# EAGLE design ziffy_board_v4 (EAGLE 6.5.0)
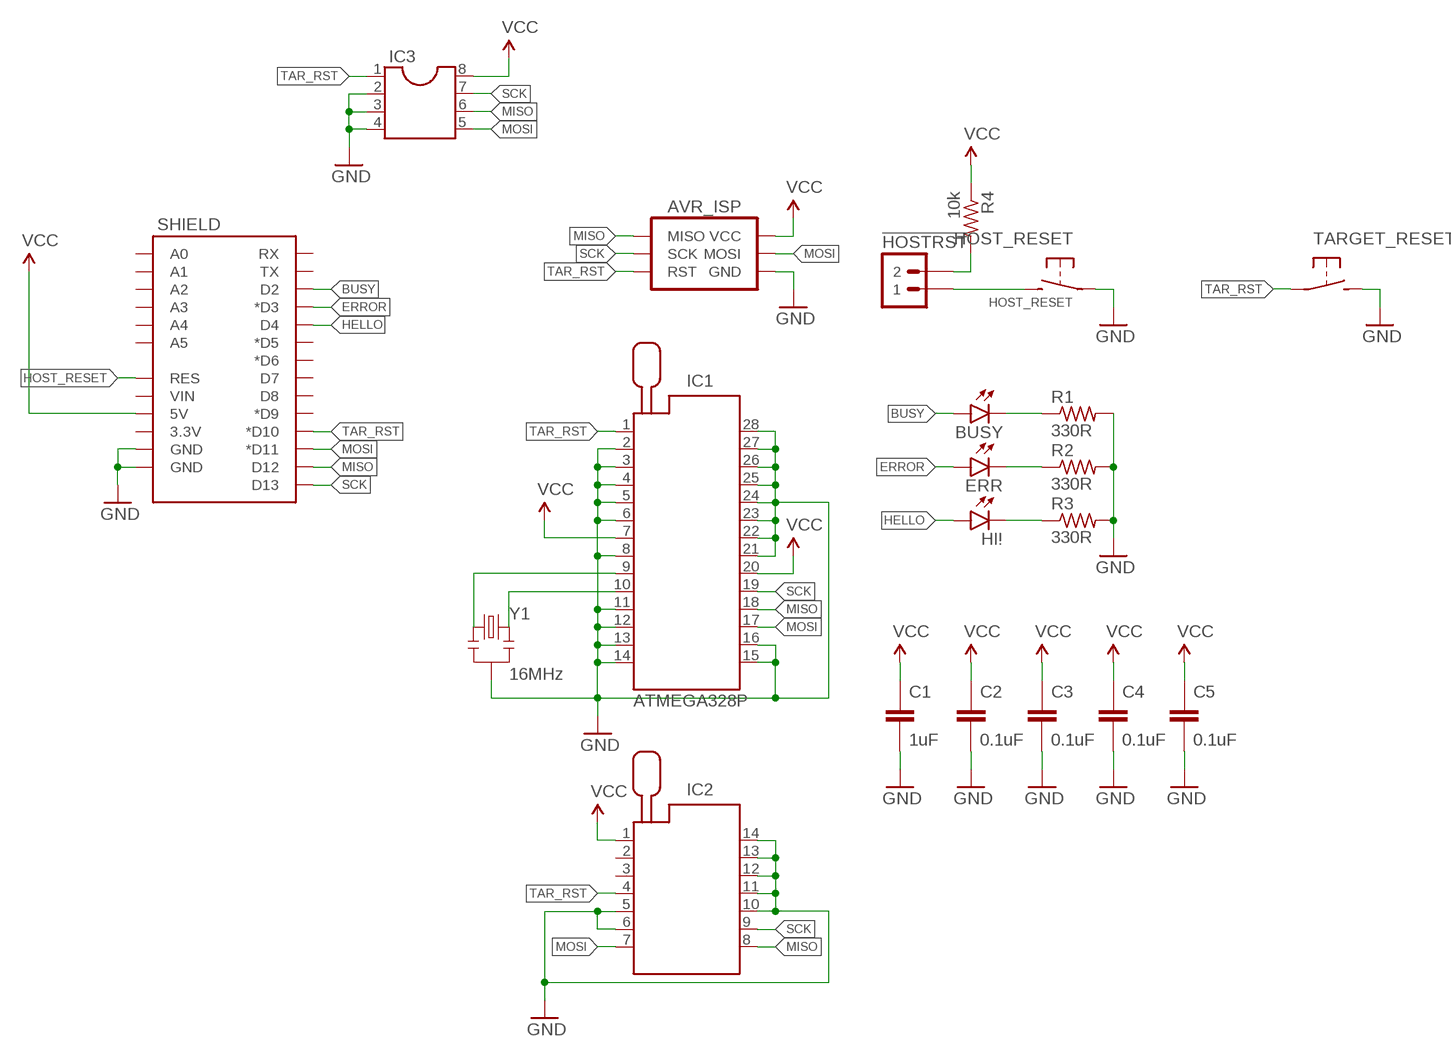
[diagram p0: schematic, sheet 1]

## Parts
!HOSTRST  M02PTH  [1X02]
AVR_ISP  AVR_SPI_PRG_6PTH-SHROUD  [2X3-SHROUDED]
BUSY  YELLOW  LED3MM  [LED3MM]
C1  1uF  CAPACITOR-CERAMIC025-024X044  [C025-024X044]
C2  0.1uF  CAPACITOR-CERAMIC025-024X044  [C025-024X044]
C3  0.1uF  CAPACITOR-CERAMIC025-024X044  [C025-024X044]
C4  0.1uF  CAPACITOR-CERAMIC025-024X044  [C025-024X044]
C5  0.1uF  CAPACITOR-CERAMIC025-024X044  [C025-024X044]
ERR  RED  LED3MM  [LED3MM]
HI!  GREEN  LED3MM  [LED3MM]
HOST_RESET  SPST-NO-TACT3MM-PTH-SMALL-PADS  [DTS-3-SMALL-PADS]
IC1  ATMEGA328P  ZIF28  [ZIF28]
IC2  ATTINY84  ZIF14  [ZIF14]
IC3  DIL8  [DIL08]
R1  330R  RESISTORPTH-AXIAL-6.35MM  [RESISTOR-AXIAL-PTH-6.35MM]
R2  330R  RESISTORPTH-AXIAL-6.35MM  [RESISTOR-AXIAL-PTH-6.35MM]
R3  330R  RESISTORPTH-AXIAL-6.35MM  [RESISTOR-AXIAL-PTH-6.35MM]
R4  10k  RESISTORPTH-AXIAL-5.08MM  [RESISTOR-AXIAL-PTH-5.08MM]
SHIELD  ARDUINO_SHIELD_SMALLER  [ARDUINO_SHIELD_NOOUTLINE_INSIDE_SMALLER]
TARGET_RESET  SPST-NO-TACT3MM-PTH-SMALL-PADS  [DTS-3-SMALL-PADS]
Y1  16MHz  RESONATORPTH  [RESONATOR-PTH]

## Nets
BUSY: BUSY.A SHIELD.D2
ERROR: ERR.A SHIELD.D3(*D3)
GND: AVR_ISP.6(GND) C1.2 C2.2 C3.2 C4.2 C5.2 HOST_RESET.1 IC1.2 IC1.3 IC1.4 IC1.5 IC1.6 IC1.8 IC1.11 IC1.12 IC1.13 IC1.14 IC1.15 IC1.16 IC1.21 IC1.22 IC1.23 IC1.24 IC1.25 IC1.26 IC1.27 IC1.28 IC2.5 IC2.6 IC2.10 IC2.11 IC2.12 IC2.13 IC2.14 IC3.2 IC3.3 IC3.4 R1.P$2 R2.P$2 R3.P$2 SHIELD.GND@0(GND) SHIELD.GND@1(GND) TARGET_RESET.2 Y1.2
HELLO: HI!.A SHIELD.D4
HOST_RESET: !HOSTRST.1 HOST_RESET.2 SHIELD.RES
MISO: AVR_ISP.1(MISO) IC1.18 IC2.8 IC3.6 SHIELD.D12
MOSI: AVR_ISP.4(MOSI) IC1.17 IC2.7 IC3.5 SHIELD.D11(*D11)
N$1: BUSY.K(C) R1.P$1
N$2: ERR.K(C) R2.P$1
N$3: HI!.K(C) R3.P$1
N$4: !HOSTRST.2 R4.P$2
N$29: IC1.9 Y1.1
N$33: IC1.10 Y1.3
SCK: AVR_ISP.3(SCK) IC1.19 IC2.9 IC3.7 SHIELD.D13
TAR_RST: AVR_ISP.5(RST) IC1.1 IC2.4 IC3.1 SHIELD.D10(*D10) TARGET_RESET.1
VCC: AVR_ISP.2(VCC) C1.1 C2.1 C3.1 C4.1 C5.1 IC1.7 IC1.20 IC2.1 IC3.8 R4.P$1 SHIELD.5V
Unconnected: IC2.2 IC2.3 SHIELD.3.3V SHIELD.A0 SHIELD.A1 SHIELD.A2 SHIELD.A3 SHIELD.A4 SHIELD.A5 SHIELD.D5(*D5) SHIELD.D6(*D6) SHIELD.D7 SHIELD.D8 SHIELD.D9(*D9) SHIELD.RX SHIELD.TX SHIELD.VIN

## Library data of the parts
!HOSTRST = A_butts:M02: Standard 2-pin 0.1" header. Use with - straight break away headers ( PRT-00116) - right angle break away headers (PRT-00553) - swiss pins (PRT-00743) - machine pins (PRT-00117) - female headers (PRT-00115) Molex polarized connector foot print use with: PRT-08233 with associated crimp pins and housings. 2.54_SCREWTERM for use with PRT-10571. 3.5mm Screw Terminal footprints for PRT-08084 5mm Screw Terminal footprints for use with PRT-08433
AVR_ISP = A_butts:AVR_SPI_PRG_6: AVR ISP 6 Pin This is the reduced ISP connector for AVR programming. Common on Arduino. This footprint will take up less PCB space and can be used with a 10-pin to 6-pin adapter such as SKU: BOB-08508 **Special note about "TEST_POINT" package. The stop mask is on the top side, so if you want your programming test points to be on the bottom of your board, make sure to place this package on the bottom side of the board. This also ensure that the orientation to program from the bottom side will be correct.
BUSY ERR HI! = A_butts:LED: LEDs Standard schematic elements and footprints for 5mm, 3mm, 1206, and 0603 sized LEDs. 5mm - Spark Fun Electronics SKU : COM-00529 (and others)
C1-C5 = A_butts:CAPACITOR-CERAMIC: CAPACITOR, European symbol
HOST_RESET TARGET_RESET = A_butts:SPST-NO-TACT
IC1 = A_butts:ZIF28: Zero Insertion Force Socked Source: http://www.3M.com/ehpd
IC2 = A_butts:ZIF14: Zero Insertion Force Socked Source: http://www.3M.com/ehpd; MF: 3M; MPN: 214-3339-00-0602J; OC_FARNELL: 1247151; OC_NEWARK: 85K7793
IC3 = A_butts:DIL8: Dual In Line / Socket
R1-R4 = A_butts:RESISTOR: RESISTOR, American symbol
SHIELD = A_butts:ARDUINO_SHIELD_SMALLER
Y1 = A_butts:RESONATOR: Resonator Small SMD resonator. Used, eg, on the Arduino Pro/ Pro Mini boards. 8MHz- XTAL-08895 16MHz- XTAL-08900

## Board
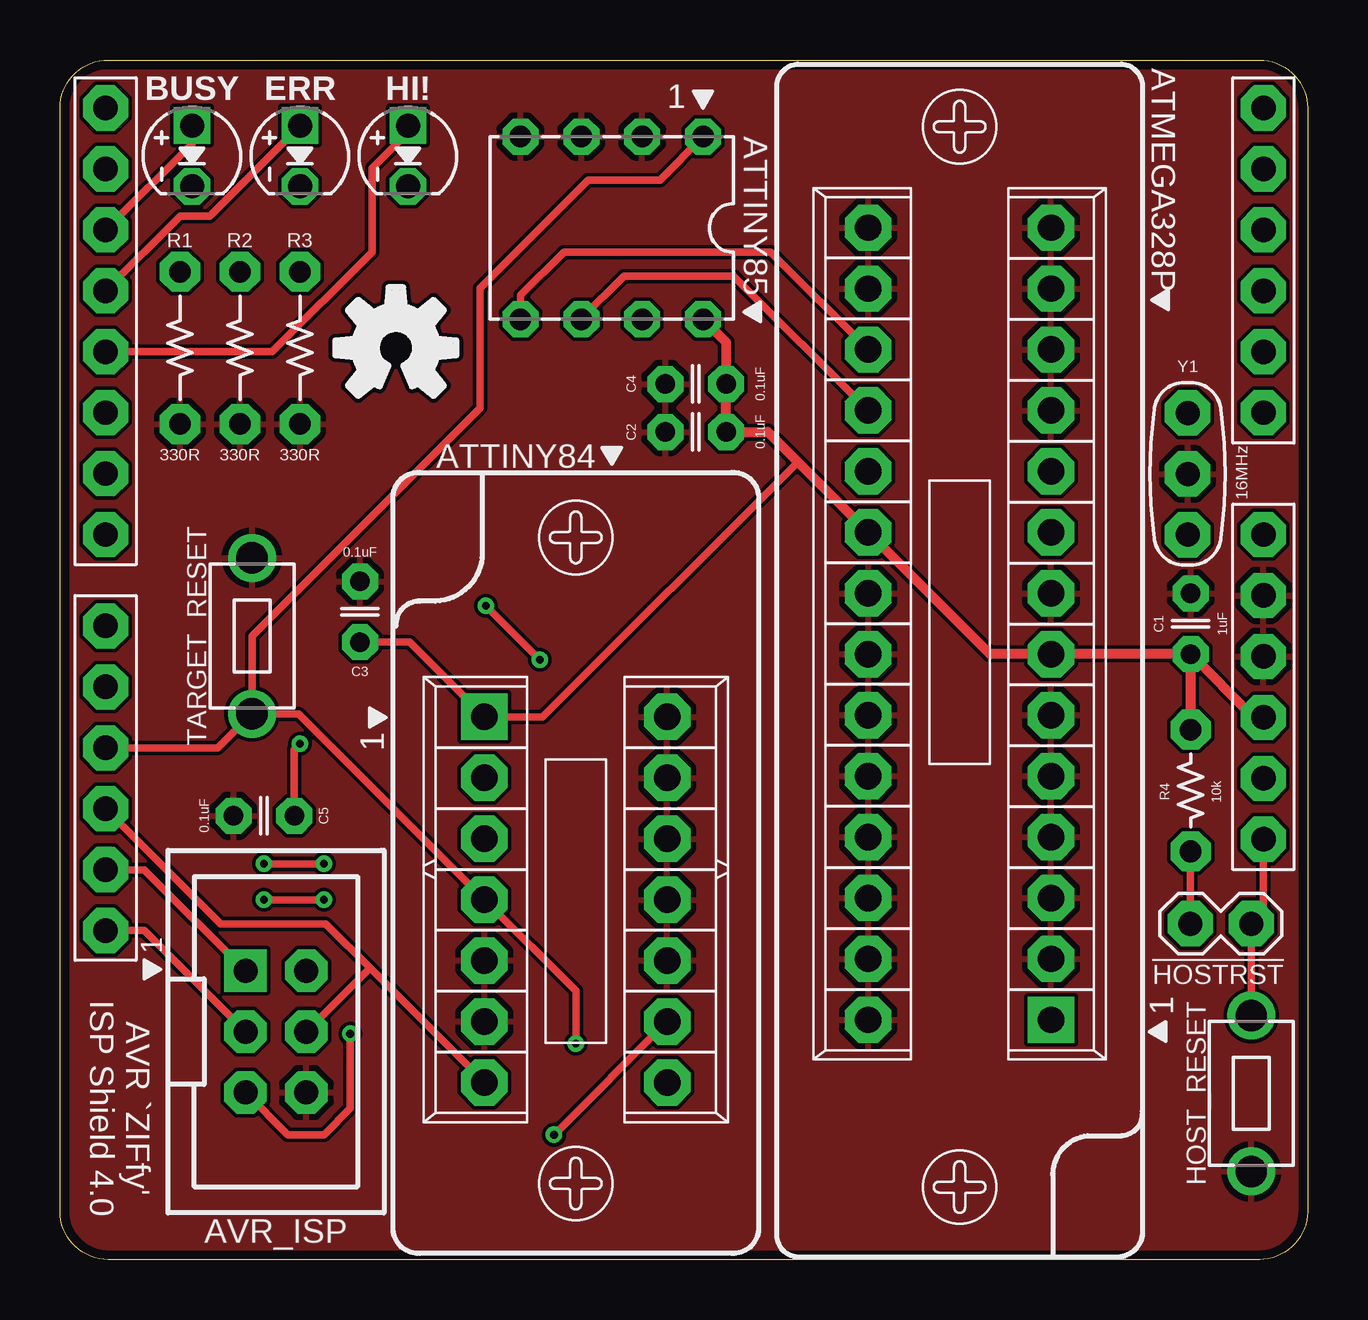
[diagram p1: board, top side]
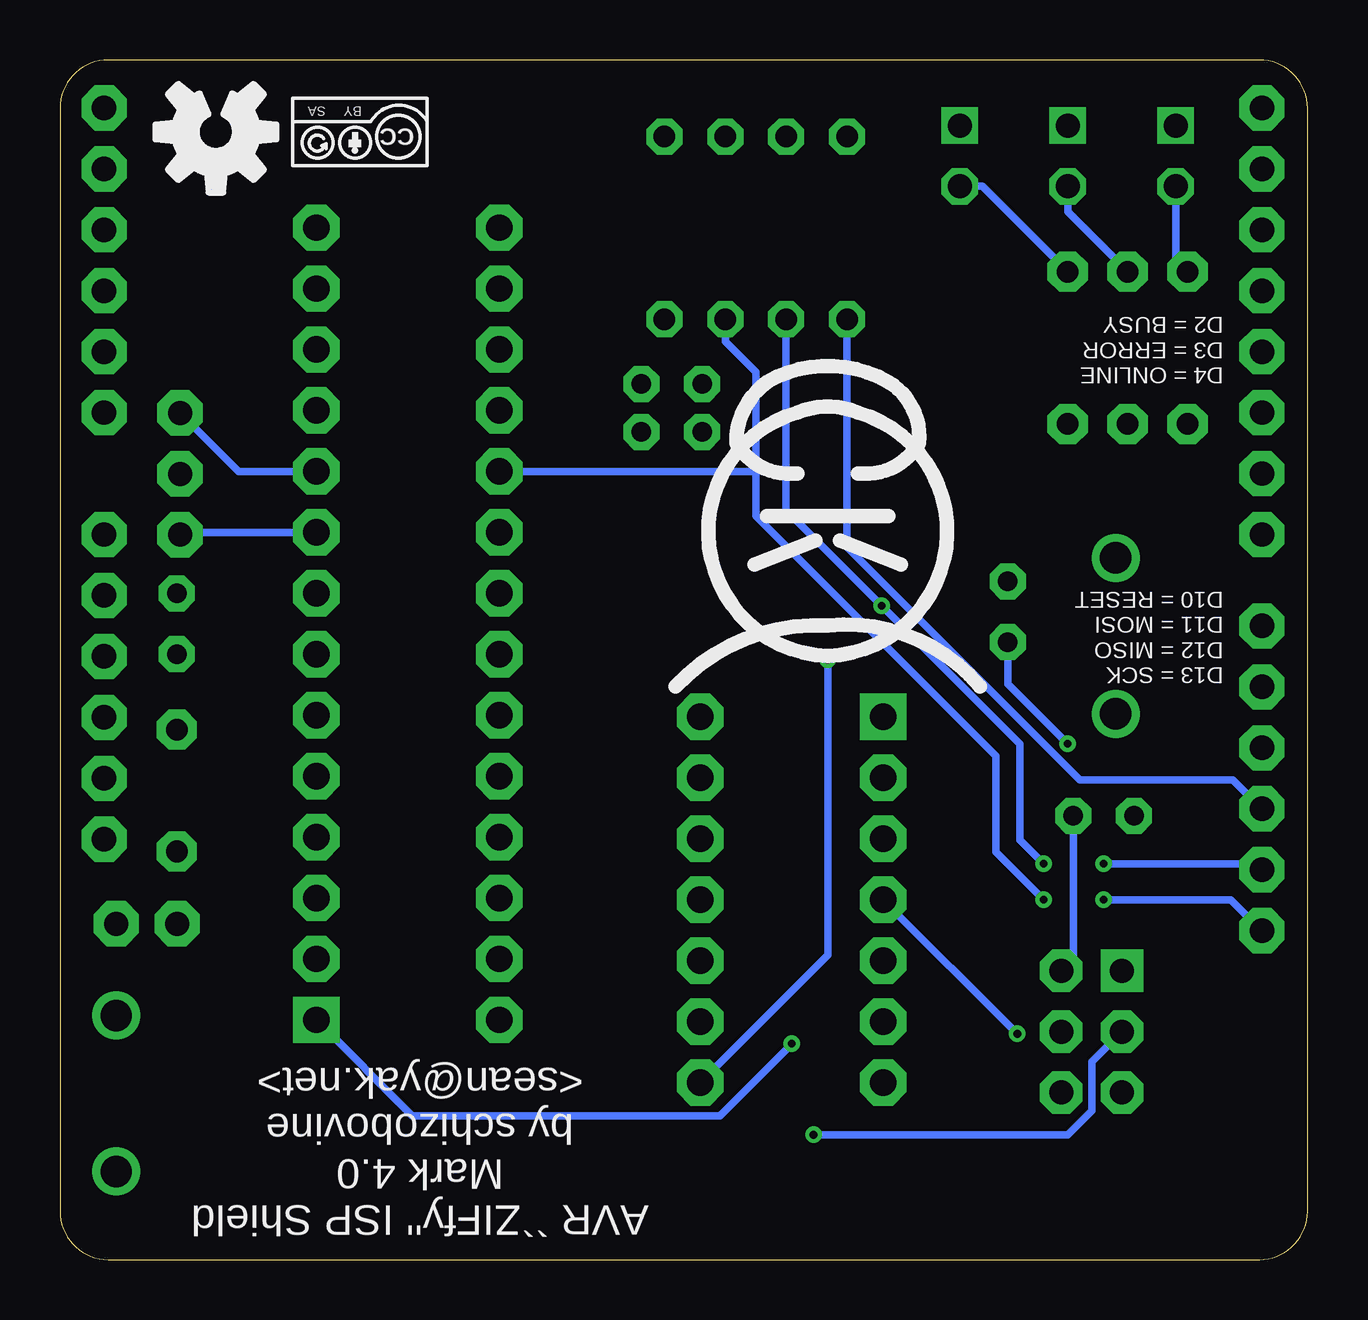
[diagram p2: board, bottom side, seen from below]

Size 52 x 50 mm. Coordinates in mm from the lower left corner, seen from the top.
Outline: 50,0 2,0 arc-90 0,2 0,48 arc-90 2,50 50,50 arc-90 52,48 52,2 arc-90 50,0
Copper layers (1*16): Top 0.0356mm / dielectric 1.5011mm / Bottom 0.0356mm
Design rules "LaenPCBOrder2": minimum track width 6mil, minimum drill 13mil, track to track 6mil, track to pad 6mil, pad to pad 6mil, via to via 6mil, smd to smd 6mil, copper to edge 15mil, drill to drill 6mil, minimum pad ring 7mil, minimum via ring 7mil, stop-mask expansion 3mil, vias tented up to drill 20mil, thermal gap 10mil

### Footprints (pad centres in the part's own frame; a part is rotated, then mirrored left to right if it is on the bottom)
1X02 = drill 1 pad 1.88 octagon: 1 0,0; 2 2.54,0
2X3-SHROUDED = drill 1 pad 1.778 square: 1 -1.27,2.54 | drill 1 pad 1.778 octagon: 2 1.27,2.54; 3 -1.27,0; 4 1.27,0; 5 -1.27,-2.54; 6 1.27,-2.54
LED3MM = drill 1 pad 1.524 square: A -1.27,0 | drill 1 pad 1.524 octagon: K 1.27,0
C025-024X044 = drill 0.813 pad 1.5 octagon: 1 -1.27,0; 2 1.27,0
DTS-3-SMALL-PADS = drill 1.3 pad 2: 1 -3.25,0; 2 3.25,0
ZIF28 = drill 1.1 pad 1.93 square: 1 -16.51,-3.81 | drill 1.1 pad 1.93 octagon: 2 -13.97,-3.81; 3 -11.43,-3.81; 4 -8.89,-3.81; 5 -6.35,-3.81; 6 -3.81,-3.81; 7 -1.27,-3.81; 8 1.27,-3.81; 9 3.81,-3.81; 10 6.35,-3.81; 11 8.89,-3.81; 12 11.43,-3.81; 13 13.97,-3.81; 14 16.51,-3.81; 15 16.51,3.81; 16 13.97,3.81; 17 11.43,3.81; 18 8.89,3.81; 19 6.35,3.81; 20 3.81,3.81; 21 1.27,3.81; 22 -1.27,3.81; 23 -3.81,3.81; 24 -6.35,3.81; 25 -8.89,3.81; 26 -11.43,3.81; 27 -13.97,3.81; 28 -16.51,3.81
ZIF14 = drill 1.1 pad 1.93 square: 1 -7.62,-3.81 | drill 1.1 pad 1.93 octagon: 2 -5.08,-3.81; 3 -2.54,-3.81; 4 0,-3.81; 5 2.54,-3.81; 6 5.08,-3.81; 7 7.62,-3.81; 8 7.62,3.81; 9 5.08,3.81; 10 2.54,3.81; 11 0,3.81; 12 -2.54,3.81; 13 -5.08,3.81; 14 -7.62,3.81
DIL08 = drill 0.9 pad 1.5 octagon: 1 -3.81,-3.81; 2 -1.27,-3.81; 3 1.27,-3.81; 4 3.81,-3.81; 5 3.81,3.81; 6 1.27,3.81; 7 -1.27,3.81; 8 -3.81,3.81
RESISTOR-AXIAL-PTH-6.35MM = drill 0.9 pad 1.676 octagon: P$1 -3.175,0; P$2 3.175,0
RESISTOR-AXIAL-PTH-5.08MM = drill 0.9 pad 1.676 octagon: P$1 -2.54,0; P$2 2.54,0
ARDUINO_SHIELD_NOOUTLINE_INSIDE_SMALLER = drill 1.016 pad 1.88 octagon: 3.3V 48.26,-27.94; 5V 48.26,-25.4; A0 48.26,-12.7; A1 48.26,-10.16; A2 48.26,-7.62; A3 48.26,-5.08; A4 48.26,-2.54; A5 48.26,0; D2 0,-5.08; D3 0,-7.62; D4 0,-10.16; D5 0,-12.7; D6 0,-15.24; D7 0,-17.78; D8 0,-21.59; D9 0,-24.13; D10 0,-26.67; D11 0,-29.21; D12 0,-31.75; D13 0,-34.29; GND@0 48.26,-22.86; GND@1 48.26,-20.32; RES 48.26,-30.48; RX 0,0; TX 0,-2.54; VIN 48.26,-17.78
RESONATOR-PTH = drill 1 pad 1.88 octagon: 1 -2.54,0; 2 0,0; 3 2.54,0

### Placement (x,y rotation side)
!HOSTRST  49.66,14 180 top
AVR_ISP  9,9.5 0 top
BUSY  5.5,46 270 top
C1  47.13,26.5 90 top
C2  26.5,34.5 180 top
C3  12.5,27 90 top
C4  26.5,36.5 180 top
C5  8.5,18.5 180 top
ERR  10,46 270 top
HI!  14.5,46 270 top
HOST_RESET  49.66,6.92 90 top
IC1  37.5,26.5 90 top
IC2  21.5,15 270 top
IC3  23,43 180 top
R1  5,38 270 top
R2  7.5,38 270 top
R3  10,38 270 top
R4  47.13,19.55 270 top
SHIELD  1.9,48 0 top
TARGET_RESET  8,26 90 top
U$2  [CC-BY-SA-4.0-NO-URL]  39.5,47 180 bottom
U$3  [COW]  20,31.5 180 bottom
U$5  [OSHWLOGO_TOP_0.2]  45.5,47 180 bottom
U$6  [OSHWLOGO_TOP_0.2]  14,38 0 top
Y1  47,32.75 90 top

### Tracks (layer width: path | path; a pad name or v marks a point on that pad's centre or on a via)
BUSY
  Top 0.305: SHIELD.D2 5.5,46.52 BUSY.A
ERROR
  Top 0.305: ERR.A 6.23,43.5 5,43.5 1.9,40.4 SHIELD.D3
GND
  pour Top: 50,0 2,0 arc-90 0,2 0,48 arc-90 2,50 50,50 arc-90 52,48 52,2 arc-90
HELLO
  Top 0.305: HI!.A 14.5,47 13,45.5 13,42 8.84,37.84 SHIELD.D4
HOST_RESET
  Top 0.305: SHIELD.RES 50.16,14.5 !HOSTRST.1 HOST_RESET.2
MISO  (via drill 0.33)
  Top 0.305: v8.5,16.5 v11,16.5 | v20,25 v17.75,27.25 | IC3.6 21.73,39.23 23.5,41 28.08,41 IC1.18 | SHIELD.D12 3.52,16.25 AVR_ISP.1
  Bottom 0.305: IC3.6 21.73,31.23 v17.75,27.25 12,21.5 12,17.5 v11,16.5 | v8.5,16.5 2.15,16.5 SHIELD.D12 | IC2.8 20,12.69 v20,25
MOSI
  Top 0.305: SHIELD.D11 6.69,14 11.07,14 12.98,12.09 | IC3.5 19.19,40.19 21,42 29.62,42 IC1.17 | 12.98,12.09 IC2.7 | AVR_ISP.4 12.86,12.09 12.98,12.09
  Bottom 0.305: IC3.5 19.19,29.69 9.5,20 3.11,20 SHIELD.D11
N$1
  Bottom 0.305: R1.P$1 5.5,41.67 BUSY.K
N$2
  Bottom 0.305: R2.P$1 10,43.67 ERR.K
N$3
  Bottom 0.305: R3.P$1 13.55,44.73 HI!.K
N$4
  Top 0.305: !HOSTRST.2 R4.P$2
N$29
  Bottom 0.305: IC1.9 46.9,30.31 Y1.1
N$33
  Bottom 0.305: IC1.10 44.56,32.85 Y1.3
SCK  (via drill 0.33)
  Top 0.305: v11,15 v8.5,15 | SHIELD.D13 3.52,13.71 AVR_ISP.3 | v20.59,5.2 IC2.9
  Bottom 0.305: IC3.7 24.27,38.27 23,37 23,32.85 | 23,32.85 23,31 13,21 13,17 v11,15 | v8.5,15 3.19,15 SHIELD.D13 | IC1.19 23,32.85 | AVR_ISP.3 9,8.23 9,6.2 10,5.2 v20.59,5.2
TAR_RST  (via drill 0.33)
  Top 0.305: SHIELD.D10 6.58,21.33 TARGET_RESET.1 | TARGET_RESET.1 8,26 17.5,35.5 17.5,40.5 22,45 25,45 IC3.1 | TARGET_RESET.1 9.94,22.75 IC2.4 21.5,11.19 v21.5,9 | v12.1,9.41 12.1,6.3 11,5.2 9.49,5.2 AVR_ISP.5
  Bottom 0.305: IC2.4 v12.1,9.41 | v21.5,9 24.5,6 37.32,6 IC1.1
VCC  (via drill 0.33)
  Top 0.305: C5.1 9.77,21.27 v10,21.5 | C3.1 14.58,25.73 IC2.1 20.12,22.62 30.75,33.25
  Top 0.406: SHIELD.5V 49.76,22.6 C1.1 | R4.P$1 C1.1 | C1.1 IC1.7 38.77,25.23 IC1.20 30.75,33.25 29.5,34.5 C2.1 C4.1 27.77,38.23 IC3.8
  Bottom 0.305: v10,21.5 12.5,24 C3.1 | C5.1 9.77,12.54 AVR_ISP.2

### Text on the board
tPlace: 1 | 1 | 1 | 1 | AVR `ZIFfy' / ISP Shield 4.0
bPlace: D4 = ONLINE / D3 = ERROR / D2 = BUSY | D13 = SCK / D12 = MISO / D11 = MOSI / D10 = RESET | AVR ``ZIFfy'' ISP Shield / Mark 4.0 / by schizobovine / <sean@yak.net>
tNames: ATTINY85